# Altium project PCB_Project.PrjPcb
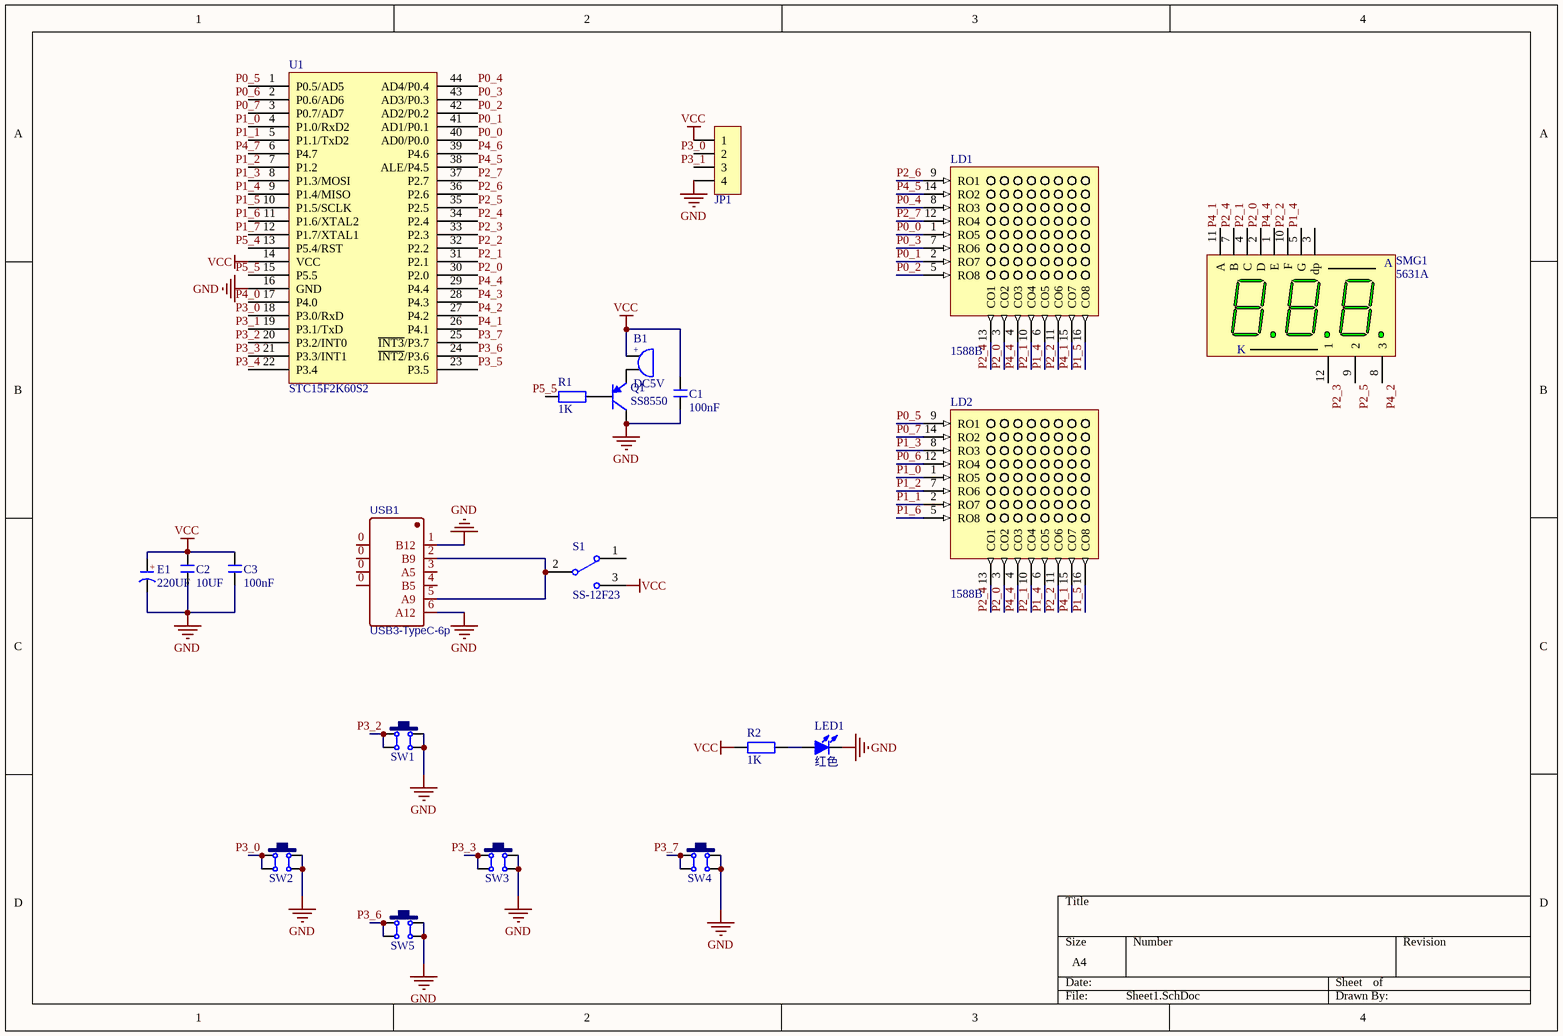
[diagram p0: Sheet1.SchDoc]
1 sheet, 21 parts. Net scope: global (net labels, ports and power ports of the same name join across sheets).
Board file: PCB1.PcbDoc

## Sheet Sheet1.SchDoc
size A4

### Parts
B1  DC5V  [BEEP 5x9x5.5]
C1  100nF  [C 0805]
C2  10UF  [C 0805]
C3  100nF  [C 0805]
E1  220UF  [CAP 2.5*5*11 - BK]
JP1  HDR-1X4  [HDR2.54-WS-4P]  (value not drawn)
LD1  1588B  [LED 8*8-38]
LD2  1588B  [LED 8*8-38]
LED1  红色  [LED 0805G]
Q1  SS8550  [SOT23-3M]
R1  1K  [R 0805]
R2  1K  [R 0805]
S1  SS-12F23  [SS-12D10]
SMG1  5631A  [SMG 0.56-3P]
SW1  6x6x5  [TSW DIP-6*6*6]  (value not drawn)
SW2  6x6x5  [TSW DIP-6*6*6]  (value not drawn)
SW3  6x6x5  [TSW DIP-6*6*6]  (value not drawn)
SW4  6x6x5  [TSW DIP-6*6*6]  (value not drawn)
SW5  6x6x5  [TSW DIP-6*6*6]  (value not drawn)
U1  STC15F2K60S2  [LQFP44 10X10_M]
USB1  USB3-TypeC-6p  [USB-TYPE-C-SMD6]

### Nets
GND: C1.1 C2.1 C3.1 E1.2(K) JP1.4 LED1.2(K) Q1.3(C) SW1.2 SW1.3 SW2.2 SW2.3 SW3.2 SW3.3 SW4.2 SW4.3 SW5.2 SW5.3 U1.16(GND) USB1.1(B12) USB1.6(A12)
VCC: B1.1 C1.2 C2.2 C3.2 E1.1(A) JP1.1 R2.1 S1.3 U1.14(VCC)
P0_0: LD1.1(RO5) U1.40(AD0/P0.0)
P0_1: LD1.2(RO7) U1.41(AD1/P0.1)
P0_2: LD1.5(RO8) U1.42(AD2/P0.2)
P0_3: LD1.7(RO6) U1.43(AD3/P0.3)
P0_4: LD1.8(RO3) U1.44(AD4/P0.4)
P0_5: LD2.9(RO1) U1.1(P0.5/AD5)
P0_6: LD2.12(RO4) U1.2(P0.6/AD6)
P0_7: LD2.14(RO2) U1.3(P0.7/AD7)
P1_0: LD2.1(RO5) U1.4(P1.0/RxD2)
P1_1: LD2.2(RO7) U1.5(P1.1/TxD2)
P1_2: LD2.7(RO6) U1.7(P1.2)
P1_3: LD2.8(RO3) U1.8(P1.3/MOSI)
P1_4: LD1.6(CO5) LD2.6(CO5) SMG1.5(G) U1.9(P1.4/MISO)
P1_5: LD1.16(CO8) LD2.16(CO8) U1.10(P1.5/SCLK)
P1_6: LD2.5(RO8) U1.11(P1.6/XTAL2)
P1_7: U1.12(P1.7/XTAL1)
P2_0: LD1.3(CO2) LD2.3(CO2) SMG1.2(D) U1.30(P2.0)
P2_1: LD1.10(CO4) LD2.10(CO4) SMG1.4(C) U1.31(P2.1)
P2_2: LD1.11(CO6) LD2.11(CO6) SMG1.10(F) U1.32(P2.2)
P2_3: SMG1.12(1) U1.33(P2.3)
P2_4: LD1.13(CO1) LD2.13(CO1) SMG1.7(B) U1.34(P2.4)
P2_5: SMG1.9(2) U1.35(P2.5)
P2_6: LD1.9(RO1) U1.36(P2.6)
P2_7: LD1.12(RO4) U1.37(P2.7)
P3_0: JP1.2 SW2.1 SW2.4 U1.18(P3.0/RxD)
P3_1: JP1.3 U1.19(P3.1/TxD)
P3_2: SW1.1 SW1.4 U1.20(P3.2/INT0)
P3_3: SW3.1 SW3.4 U1.21(P3.3/INT1)
P3_4: U1.22(P3.4)
P3_5: U1.23(P3.5)
P3_6: SW5.1 SW5.4 U1.24(~{INT2}/P3.6)
P3_7: SW4.1 SW4.4 U1.25(~{INT3}/P3.7)
P4_0: U1.17(P4.0)
P4_1: LD1.15(CO7) LD2.15(CO7) SMG1.11(A) U1.26(P4.1)
P4_2: SMG1.8(3) U1.27(P4.2)
P4_3: U1.28(P4.3)
P4_4: LD1.4(CO3) LD2.4(CO3) SMG1.1(E) U1.29(P4.4)
P4_5: LD1.14(RO2) U1.38(ALE/P4.5)
P4_6: U1.39(P4.6)
P4_7: U1.6(P4.7)
P5_4: U1.13(P5.4/RST)
P5_5: R1.1 U1.15(P5.5)
NetB1_2: B1.2 Q1.2(E)
NetLED1_1: LED1.1(A) R2.2
NetQ1_1: Q1.1(B) R1.2
NetS1_2: S1.2 USB1.2(B9) USB1.5(A9)

Not connected (* = marked no-connect by the designer): S1 1; SMG1 3(dp); USB1 0 3(A5) 4(B5)

### Notes on the sheet
- (in symbol 5631A) K
- (in symbol BEEP) +
- (in symbol C-CAP) +

### Library data of the parts
B1 = BEEP: 蜂鸣器; 版权归属: 黎明电子style; BOM名称: 蜂鸣器; 学习资源: https://lmdzstyle.taobao.com/
C1-C3 = C: 无极性贴片电容; 版权归属: 黎明电子style; BOM名称: 无极性贴片电容; 学习资源: https://lmdzstyle.taobao.com/
E1 = C-CAP: 直插电解电容; 版权归属: 黎明电子style; BOM名称: 直插电解电容; 学习资源: https://lmdzstyle.taobao.com/
JP1 = Header 4: 4P接插件; 版权归属: 黎明电子style; BOM名称: 4P接插件; 学习资源: https://lmdzstyle.taobao.com/
LD1 LD2 = 1588B: 共阳单色LED8*8点阵屏; 版权归属: 黎明电子style; BOM名称: 共阳单色LED8*8点阵屏; 学习资源: https://lmdzstyle.taobao.com/
LED1 = LED-SMD: 贴片LED; 版权归属: 黎明电子style; BOM名称: 贴片LED; 学习资源: https://lmdzstyle.taobao.com/
Q1 = 8550-SMD: 高频放大-PNP型; 版权归属: 源创客; 属性: 40V 1.5A 1W 100MHZ; BOM名称: 高频放大-PNP型; 学习资源: www.ooocke.com
R1 R2 = R: 贴片电阻; 版权归属: 黎明电子style; BOM名称: 贴片电阻; 学习资源: https://lmdzstyle.taobao.com/
S1 = SSW-1P: 1路波动开关; BOM名称: 波动开关; 版权归属: 黎明电子style; 学习资源: https://lmdzstyle.taobao.com/
SMG1 = 5631A: 0.56寸3位共阴数码管; 版权归属: 黎明电子style; BOM名称: 0.56寸3位共阴; 学习资源: https://lmdzstyle.taobao.com/
SW1-SW5 = TSW DIP-6x6: 直插6x6轻触开关; 版权归属: 黎明电子style; BOM名称: 直插6x6轻触开关; 学习资源: https://lmdzstyle.taobao.com/
U1 = STC15F2K60S2-44pin: STC单片机; 版权归属: 校基地硬件部; BOM名称: STC单片机